# EAGLE design circuito_distanciamento_social_ESP-01 (EAGLE 9.6.1)
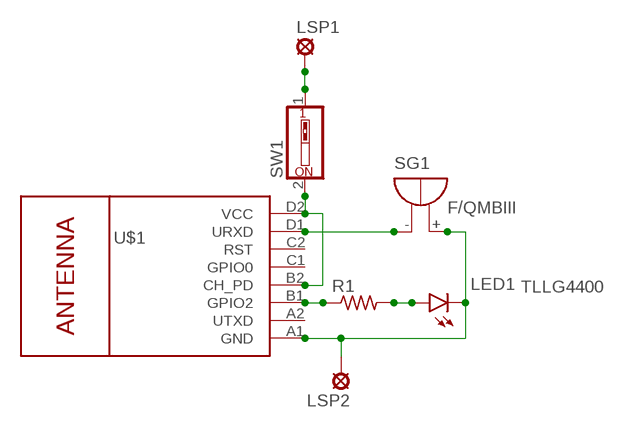
[diagram p0: schematic, sheet 1]

## Parts
LED1  TLLG4400  [LED3MM]
LSP1  LSP13  [LSP13]
LSP2  LSP13  [LSP13]
R1  R-US_0204/7  [0204/7]
SG1  F/QMBIII  [F/QMBIII]
SW1  SW_DIP-1  [EDG-01]
U$1  WIRELESS-WIFI-ESP-01  [WIRELESS-WIFI-ESP-01]

## Nets
N$1: SW1.2 U$1.B2(CH_PD) U$1.D2(VCC)
N$3: R1.1 U$1.B1(GPIO2)
N$4: LED1.A R1.2
N$5: SG1.-(+) U$1.D1(URXD)
N$6: LSP1.MP SW1.1
N$7: LED1.K(C) LSP2.MP SG1.+(-) U$1.A1(GND)
Unconnected: U$1.A2(UTXD) U$1.C1(GPIO0) U$1.C2(RST)

## Library data of the parts
LED1 = led:TLLG4400: Low Current (2mA) LED 3 mm Tinted Diffused Package color GREEN Source: Data sheet <http://www.farnell.com/datasheets/391098.pdf>; MF: VISHAY SEMICONDUCTOR; OC_FARNELL: 1612435
LSP1 LSP2 = solpad:LSP13: SOLDER PAD drill 1.3 mm, distributor Buerklin, 12H562
R1 = rcl:R-US_: RESISTOR, American symbol; SPICEPREFIX: R
SG1 = buzzer:F/QMBIII: BUZZER Source: Buerklin; OC_FARNELL: unknown; OC_NEWARK: unknown
SW1 = special:SW_DIP-1: DIP SWITCH
U$1 = diy-modules:WIRELESS-WIFI-ESP-01: Wireless Wi-Fi ESP-01 Module based on ESP8266 chip Click here to find device on ebay.com <http://www.ebay.com/sch/esp8266+esp+01+transceiver>

## Board
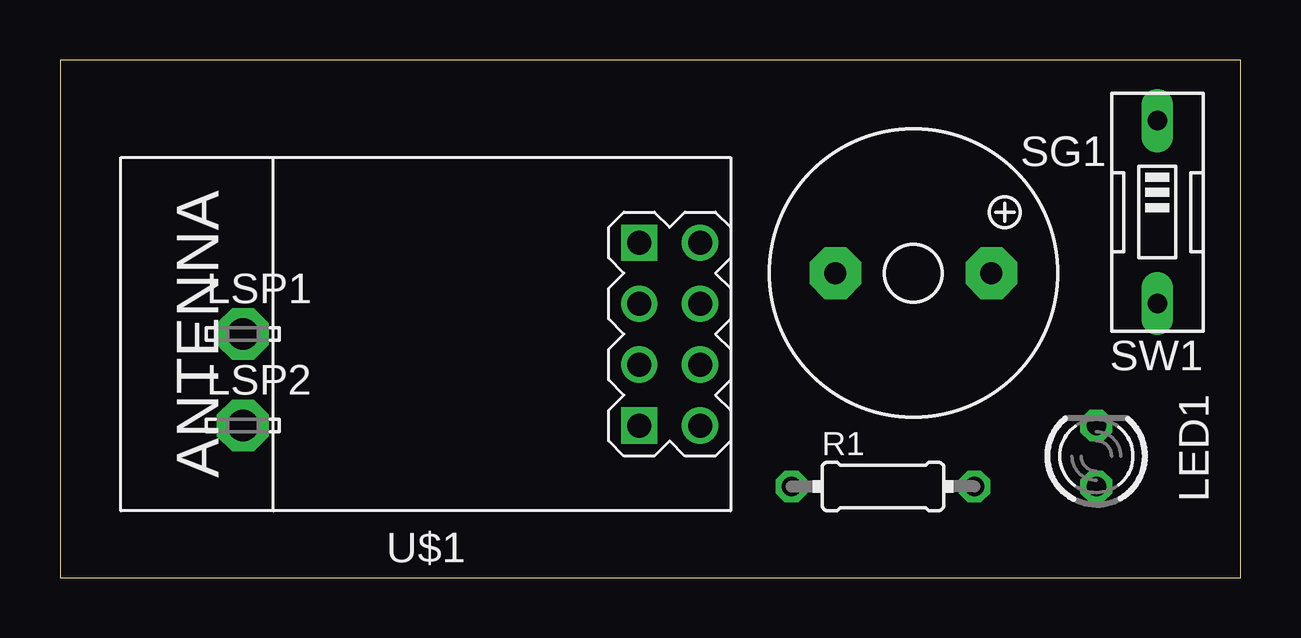
[diagram p1: board, top side]
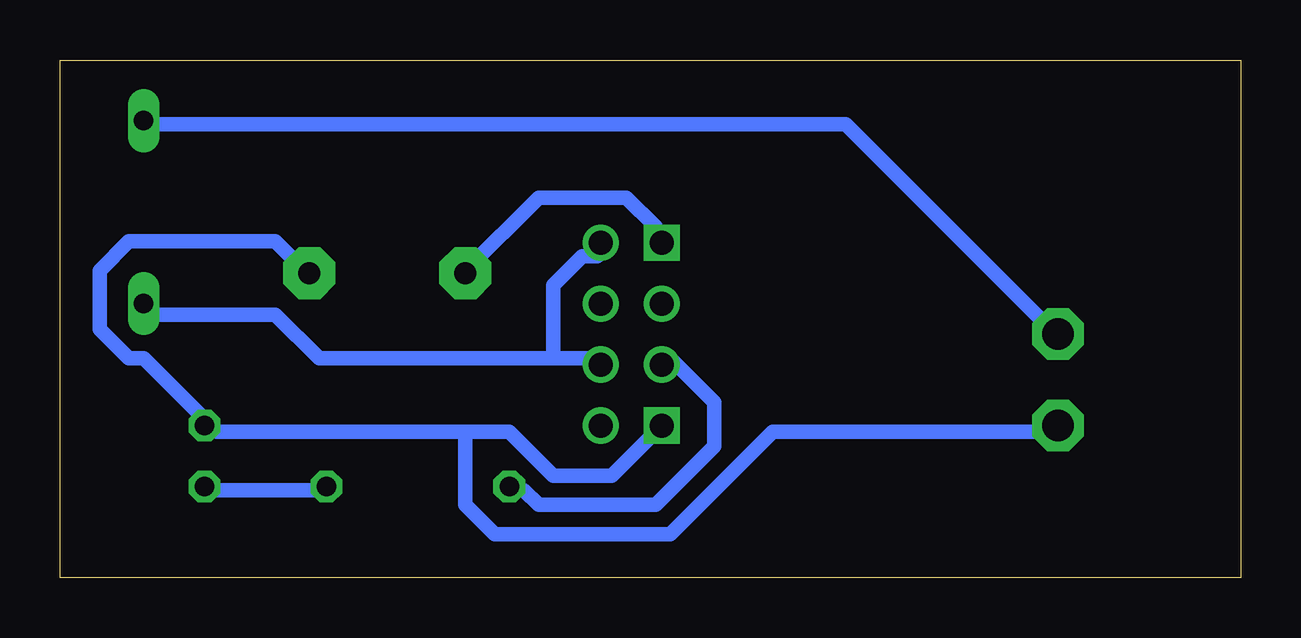
[diagram p2: board, bottom side, seen from below]

Size 49.2 x 21.58 mm. Coordinates in mm from the lower left corner, seen from the top.
Outline: 0,0 49.2,0 49.2,21.58 0,21.58 0,0
Copper layers (1*16): Top 0.035mm / dielectric 1.5mm / Bottom 0.035mm
Design rules "default *": minimum track width 24mil, minimum drill 0.35mm, track to track 24mil, track to pad 24mil, pad to pad 24mil, via to via 24mil, smd to smd 6mil, copper to edge 40mil, drill to drill 24mil, minimum pad ring 10mil, minimum via ring 8mil, stop-mask expansion 4mil, vias tented up to drill 0mil, thermal gap 10mil

### Footprints (pad centres in the part's own frame; a part is rotated, then mirrored left to right if it is on the bottom)
LED3MM = drill 0.813 octagon: A -1.27,0; K 1.27,0
LSP13 = drill 1.321 pad 2.159 octagon: MP 0,0
0204/7 = drill 0.813 octagon: 1 -3.81,0; 2 3.81,0
F/QMBIII = drill 0.914 pad 2.159 octagon: + 3.251,0; - -3.251,0
EDG-01 = drill 0.813 long: 1 0,-3.81; 2 0,3.81
WIRELESS-WIFI-ESP-01 = drill 1 square: A1 -8.89,3.81; D1 -8.89,-3.81 | drill 1: A2 -11.43,3.81; B1 -8.89,1.27; B2 -11.43,1.27; C1 -8.89,-1.27; C2 -11.43,-1.27; D2 -11.43,-3.81

### Placement (x,y rotation side)
LED1  43.18,5.08 90 top
LSP1  7.62,10.16 0 top
LSP2  7.62,6.35 0 top
R1  34.29,3.81 0 top
SG1  35.56,12.7 0 top
SW1  45.72,15.24 180 top
U$1  15.24,10.16 180 top

### Tracks (layer width: path | path; a pad name or v marks a point on that pad's centre or on a via)
N$1
  Bottom 0.61: 28.65,9.14 26.82,9.14 U$1.B2 | 28.65,9.14 38.41,9.14 40.23,10.97 45.72,10.97 SW1.2 | 28.65,9.14 28.65,12.19 27.43,13.41 26.82,13.41 U$1.D2
N$3
  Bottom 0.61: R1.1 30.48,3.66 29.87,3.66 29.26,3.05 24.38,3.05 21.95,5.49 21.95,7.32 23.77,9.14 U$1.B1
N$4
  Bottom 0.61: R1.2 38.41,3.66 42.67,3.66 LED1.A
N$5
  Bottom 0.61: U$1.D1 24.38,14.02 24.38,14.63 25.6,15.85 29.26,15.85 32.31,12.8 SG1.-
N$6
  Bottom 0.61: SW1.1 45.72,18.9 16.46,18.9 7.92,10.36 LSP1.MP
N$7
  Bottom 0.61: SG1.+ 39.01,12.8 40.23,14.02 46.33,14.02 47.55,12.8 47.55,10.36 46.33,9.14 45.72,9.14 43.28,6.71 LED1.K 42.67,6.1 32.31,6.1 | U$1.A1 26.21,4.27 28.65,4.27 30.48,6.1 32.31,6.1 | 32.31,6.1 32.31,3.05 31.09,1.83 23.77,1.83 19.51,6.1 7.92,6.1 LSP2.MP